# EAGLE schematic zxld383-boost-driver-12mm-mk-3 (EAGLE 6.4)
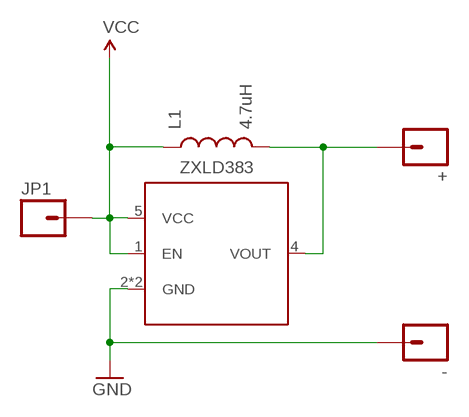
[diagram p0: schematic, sheet 1]

## Parts
+  M01PTH-1.2MM  [1X01-1.2MM]
-  M01PTH-1.2MM-NS  [1X01-1.2MM-NS]
JP1  M01NOT-A-VIA-NOPE  [1X01_NOSILK_NOSTOP]
L1  4.7uH  INDUCTOR1007  [1007]
ZXLD383  ZXLD383  [TSOT-23-5]

## Nets
GND: -.P$1 ZXLD383.2(GND) ZXLD383.3(GND)
VCC: JP1.P$1 L1.1 ZXLD383.1(EN) ZXLD383.5(VCC)
VOUT: +.P$1 L1.2 ZXLD383.4(VOUT)

## Library data of the parts
+ - JP1 = A_butts:M01: Header 1 Standard 1-pin 0.1" header. Use with straight break away headers (SKU : PRT-00116), right angle break away headers (PRT-00553), swiss pins (PRT-00743), machine pins (PRT-00117), and female headers (PRT-00115).
L1 = A_butts:INDUCTOR: Inductors Basic Inductor/Choke - 0603 and 1206. Footprints are not proven and vary greatly between part numbers. SRN6045- 33uH, 20% 1.4A SDR0403-560KL - 56uH, 10%, 500mA RMS/740mA peak
ZXLD383 = A_butts:ZXLD383